# Altium project volumetric-display-boards.PrjPcb (part 2 of 2)
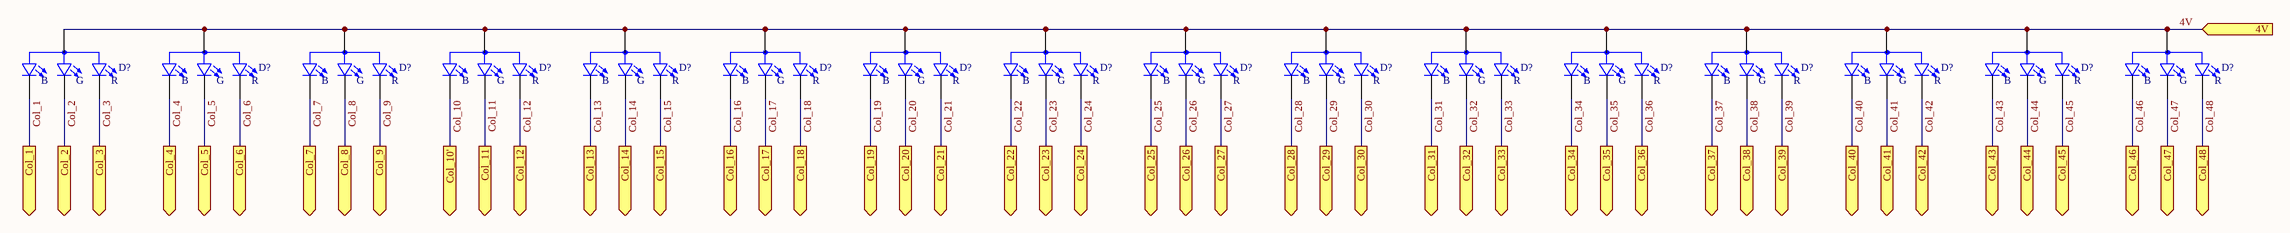
[diagram p2: LED_Row.SchDoc]

## Nets that join several sheets
4V: LED_Row1 (16 pins), LED_Row2 (16 pins), LED_Row3 (16 pins), LED_Row4 (16 pins), LED_Row5 (16 pins), LED_Row6 (16 pins), LED_Row7 (16 pins), LED_Row8 (16 pins), LED_Row9 (16 pins), LED_Row10 (16 pins), LED_Row11 (16 pins), LED_Row12 (16 pins), LED_Row13 (16 pins), LED_Row14 (16 pins), LED_Row15 (16 pins), LED_Row16 (16 pins), LED_Row17 (16 pins), LED_Row18 (16 pins), LED_Row19 (16 pins), LED_Row20 (16 pins), LED_Row21 (16 pins), LED_Row22 (16 pins), LED_Row23 (16 pins), LED_Row24 (16 pins)
Col_1: LED_Row1 (D1_LED_Row1.2), LED_Row2 (D1_LED_Row2.2), LED_Row3 (D1_LED_Row3.2), LED_Row4 (D1_LED_Row4.2), LED_Row5 (D1_LED_Row5.2), LED_Row6 (D1_LED_Row6.2), LED_Row7 (D1_LED_Row7.2), LED_Row8 (D1_LED_Row8.2), LED_Row9 (D1_LED_Row9.2), LED_Row10 (D1_LED_Row10.2), LED_Row11 (D1_LED_Row11.2), LED_Row12 (D1_LED_Row12.2), LED_Row13 (D1_LED_Row13.2), LED_Row14 (D1_LED_Row14.2), LED_Row15 (D1_LED_Row15.2), LED_Row16 (D1_LED_Row16.2), LED_Row17 (D1_LED_Row17.2), LED_Row18 (D1_LED_Row18.2), LED_Row19 (D1_LED_Row19.2), LED_Row20 (D1_LED_Row20.2), LED_Row21 (D1_LED_Row21.2), LED_Row22 (D1_LED_Row22.2), LED_Row23 (D1_LED_Row23.2), LED_Row24 (D1_LED_Row24.2)
Col_2: LED_Row1 (D1_LED_Row1.1), LED_Row2 (D1_LED_Row2.1), LED_Row3 (D1_LED_Row3.1), LED_Row4 (D1_LED_Row4.1), LED_Row5 (D1_LED_Row5.1), LED_Row6 (D1_LED_Row6.1), LED_Row7 (D1_LED_Row7.1), LED_Row8 (D1_LED_Row8.1), LED_Row9 (D1_LED_Row9.1), LED_Row10 (D1_LED_Row10.1), LED_Row11 (D1_LED_Row11.1), LED_Row12 (D1_LED_Row12.1), LED_Row13 (D1_LED_Row13.1), LED_Row14 (D1_LED_Row14.1), LED_Row15 (D1_LED_Row15.1), LED_Row16 (D1_LED_Row16.1), LED_Row17 (D1_LED_Row17.1), LED_Row18 (D1_LED_Row18.1), LED_Row19 (D1_LED_Row19.1), LED_Row20 (D1_LED_Row20.1), LED_Row21 (D1_LED_Row21.1), LED_Row22 (D1_LED_Row22.1), LED_Row23 (D1_LED_Row23.1), LED_Row24 (D1_LED_Row24.1)
Col_3: LED_Row1 (D1_LED_Row1.4), LED_Row2 (D1_LED_Row2.4), LED_Row3 (D1_LED_Row3.4), LED_Row4 (D1_LED_Row4.4), LED_Row5 (D1_LED_Row5.4), LED_Row6 (D1_LED_Row6.4), LED_Row7 (D1_LED_Row7.4), LED_Row8 (D1_LED_Row8.4), LED_Row9 (D1_LED_Row9.4), LED_Row10 (D1_LED_Row10.4), LED_Row11 (D1_LED_Row11.4), LED_Row12 (D1_LED_Row12.4), LED_Row13 (D1_LED_Row13.4), LED_Row14 (D1_LED_Row14.4), LED_Row15 (D1_LED_Row15.4), LED_Row16 (D1_LED_Row16.4), LED_Row17 (D1_LED_Row17.4), LED_Row18 (D1_LED_Row18.4), LED_Row19 (D1_LED_Row19.4), LED_Row20 (D1_LED_Row20.4), LED_Row21 (D1_LED_Row21.4), LED_Row22 (D1_LED_Row22.4), LED_Row23 (D1_LED_Row23.4), LED_Row24 (D1_LED_Row24.4)
Col_4: LED_Row1 (D2_LED_Row1.2), LED_Row2 (D2_LED_Row2.2), LED_Row3 (D2_LED_Row3.2), LED_Row4 (D2_LED_Row4.2), LED_Row5 (D2_LED_Row5.2), LED_Row6 (D2_LED_Row6.2), LED_Row7 (D2_LED_Row7.2), LED_Row8 (D2_LED_Row8.2), LED_Row9 (D2_LED_Row9.2), LED_Row10 (D2_LED_Row10.2), LED_Row11 (D2_LED_Row11.2), LED_Row12 (D2_LED_Row12.2), LED_Row13 (D2_LED_Row13.2), LED_Row14 (D2_LED_Row14.2), LED_Row15 (D2_LED_Row15.2), LED_Row16 (D2_LED_Row16.2), LED_Row17 (D2_LED_Row17.2), LED_Row18 (D2_LED_Row18.2), LED_Row19 (D2_LED_Row19.2), LED_Row20 (D2_LED_Row20.2), LED_Row21 (D2_LED_Row21.2), LED_Row22 (D2_LED_Row22.2), LED_Row23 (D2_LED_Row23.2), LED_Row24 (D2_LED_Row24.2)
Col_5: LED_Row1 (D2_LED_Row1.1), LED_Row2 (D2_LED_Row2.1), LED_Row3 (D2_LED_Row3.1), LED_Row4 (D2_LED_Row4.1), LED_Row5 (D2_LED_Row5.1), LED_Row6 (D2_LED_Row6.1), LED_Row7 (D2_LED_Row7.1), LED_Row8 (D2_LED_Row8.1), LED_Row9 (D2_LED_Row9.1), LED_Row10 (D2_LED_Row10.1), LED_Row11 (D2_LED_Row11.1), LED_Row12 (D2_LED_Row12.1), LED_Row13 (D2_LED_Row13.1), LED_Row14 (D2_LED_Row14.1), LED_Row15 (D2_LED_Row15.1), LED_Row16 (D2_LED_Row16.1), LED_Row17 (D2_LED_Row17.1), LED_Row18 (D2_LED_Row18.1), LED_Row19 (D2_LED_Row19.1), LED_Row20 (D2_LED_Row20.1), LED_Row21 (D2_LED_Row21.1), LED_Row22 (D2_LED_Row22.1), LED_Row23 (D2_LED_Row23.1), LED_Row24 (D2_LED_Row24.1)
Col_6: LED_Row1 (D2_LED_Row1.4), LED_Row2 (D2_LED_Row2.4), LED_Row3 (D2_LED_Row3.4), LED_Row4 (D2_LED_Row4.4), LED_Row5 (D2_LED_Row5.4), LED_Row6 (D2_LED_Row6.4), LED_Row7 (D2_LED_Row7.4), LED_Row8 (D2_LED_Row8.4), LED_Row9 (D2_LED_Row9.4), LED_Row10 (D2_LED_Row10.4), LED_Row11 (D2_LED_Row11.4), LED_Row12 (D2_LED_Row12.4), LED_Row13 (D2_LED_Row13.4), LED_Row14 (D2_LED_Row14.4), LED_Row15 (D2_LED_Row15.4), LED_Row16 (D2_LED_Row16.4), LED_Row17 (D2_LED_Row17.4), LED_Row18 (D2_LED_Row18.4), LED_Row19 (D2_LED_Row19.4), LED_Row20 (D2_LED_Row20.4), LED_Row21 (D2_LED_Row21.4), LED_Row22 (D2_LED_Row22.4), LED_Row23 (D2_LED_Row23.4), LED_Row24 (D2_LED_Row24.4)
Col_7: LED_Row1 (D3_LED_Row1.2), LED_Row2 (D3_LED_Row2.2), LED_Row3 (D3_LED_Row3.2), LED_Row4 (D3_LED_Row4.2), LED_Row5 (D3_LED_Row5.2), LED_Row6 (D3_LED_Row6.2), LED_Row7 (D3_LED_Row7.2), LED_Row8 (D3_LED_Row8.2), LED_Row9 (D3_LED_Row9.2), LED_Row10 (D3_LED_Row10.2), LED_Row11 (D3_LED_Row11.2), LED_Row12 (D3_LED_Row12.2), LED_Row13 (D3_LED_Row13.2), LED_Row14 (D3_LED_Row14.2), LED_Row15 (D3_LED_Row15.2), LED_Row16 (D3_LED_Row16.2), LED_Row17 (D3_LED_Row17.2), LED_Row18 (D3_LED_Row18.2), LED_Row19 (D3_LED_Row19.2), LED_Row20 (D3_LED_Row20.2), LED_Row21 (D3_LED_Row21.2), LED_Row22 (D3_LED_Row22.2), LED_Row23 (D3_LED_Row23.2), LED_Row24 (D3_LED_Row24.2)
Col_8: LED_Row1 (D3_LED_Row1.1), LED_Row2 (D3_LED_Row2.1), LED_Row3 (D3_LED_Row3.1), LED_Row4 (D3_LED_Row4.1), LED_Row5 (D3_LED_Row5.1), LED_Row6 (D3_LED_Row6.1), LED_Row7 (D3_LED_Row7.1), LED_Row8 (D3_LED_Row8.1), LED_Row9 (D3_LED_Row9.1), LED_Row10 (D3_LED_Row10.1), LED_Row11 (D3_LED_Row11.1), LED_Row12 (D3_LED_Row12.1), LED_Row13 (D3_LED_Row13.1), LED_Row14 (D3_LED_Row14.1), LED_Row15 (D3_LED_Row15.1), LED_Row16 (D3_LED_Row16.1), LED_Row17 (D3_LED_Row17.1), LED_Row18 (D3_LED_Row18.1), LED_Row19 (D3_LED_Row19.1), LED_Row20 (D3_LED_Row20.1), LED_Row21 (D3_LED_Row21.1), LED_Row22 (D3_LED_Row22.1), LED_Row23 (D3_LED_Row23.1), LED_Row24 (D3_LED_Row24.1)
Col_9: LED_Row1 (D3_LED_Row1.4), LED_Row2 (D3_LED_Row2.4), LED_Row3 (D3_LED_Row3.4), LED_Row4 (D3_LED_Row4.4), LED_Row5 (D3_LED_Row5.4), LED_Row6 (D3_LED_Row6.4), LED_Row7 (D3_LED_Row7.4), LED_Row8 (D3_LED_Row8.4), LED_Row9 (D3_LED_Row9.4), LED_Row10 (D3_LED_Row10.4), LED_Row11 (D3_LED_Row11.4), LED_Row12 (D3_LED_Row12.4), LED_Row13 (D3_LED_Row13.4), LED_Row14 (D3_LED_Row14.4), LED_Row15 (D3_LED_Row15.4), LED_Row16 (D3_LED_Row16.4), LED_Row17 (D3_LED_Row17.4), LED_Row18 (D3_LED_Row18.4), LED_Row19 (D3_LED_Row19.4), LED_Row20 (D3_LED_Row20.4), LED_Row21 (D3_LED_Row21.4), LED_Row22 (D3_LED_Row22.4), LED_Row23 (D3_LED_Row23.4), LED_Row24 (D3_LED_Row24.4)
Col_10: LED_Row1 (D4_LED_Row1.2), LED_Row2 (D4_LED_Row2.2), LED_Row3 (D4_LED_Row3.2), LED_Row4 (D4_LED_Row4.2), LED_Row5 (D4_LED_Row5.2), LED_Row6 (D4_LED_Row6.2), LED_Row7 (D4_LED_Row7.2), LED_Row8 (D4_LED_Row8.2), LED_Row9 (D4_LED_Row9.2), LED_Row10 (D4_LED_Row10.2), LED_Row11 (D4_LED_Row11.2), LED_Row12 (D4_LED_Row12.2), LED_Row13 (D4_LED_Row13.2), LED_Row14 (D4_LED_Row14.2), LED_Row15 (D4_LED_Row15.2), LED_Row16 (D4_LED_Row16.2), LED_Row17 (D4_LED_Row17.2), LED_Row18 (D4_LED_Row18.2), LED_Row19 (D4_LED_Row19.2), LED_Row20 (D4_LED_Row20.2), LED_Row21 (D4_LED_Row21.2), LED_Row22 (D4_LED_Row22.2), LED_Row23 (D4_LED_Row23.2), LED_Row24 (D4_LED_Row24.2)
Col_11: LED_Row1 (D4_LED_Row1.1), LED_Row2 (D4_LED_Row2.1), LED_Row3 (D4_LED_Row3.1), LED_Row4 (D4_LED_Row4.1), LED_Row5 (D4_LED_Row5.1), LED_Row6 (D4_LED_Row6.1), LED_Row7 (D4_LED_Row7.1), LED_Row8 (D4_LED_Row8.1), LED_Row9 (D4_LED_Row9.1), LED_Row10 (D4_LED_Row10.1), LED_Row11 (D4_LED_Row11.1), LED_Row12 (D4_LED_Row12.1), LED_Row13 (D4_LED_Row13.1), LED_Row14 (D4_LED_Row14.1), LED_Row15 (D4_LED_Row15.1), LED_Row16 (D4_LED_Row16.1), LED_Row17 (D4_LED_Row17.1), LED_Row18 (D4_LED_Row18.1), LED_Row19 (D4_LED_Row19.1), LED_Row20 (D4_LED_Row20.1), LED_Row21 (D4_LED_Row21.1), LED_Row22 (D4_LED_Row22.1), LED_Row23 (D4_LED_Row23.1), LED_Row24 (D4_LED_Row24.1)
Col_12: LED_Row1 (D4_LED_Row1.4), LED_Row2 (D4_LED_Row2.4), LED_Row3 (D4_LED_Row3.4), LED_Row4 (D4_LED_Row4.4), LED_Row5 (D4_LED_Row5.4), LED_Row6 (D4_LED_Row6.4), LED_Row7 (D4_LED_Row7.4), LED_Row8 (D4_LED_Row8.4), LED_Row9 (D4_LED_Row9.4), LED_Row10 (D4_LED_Row10.4), LED_Row11 (D4_LED_Row11.4), LED_Row12 (D4_LED_Row12.4), LED_Row13 (D4_LED_Row13.4), LED_Row14 (D4_LED_Row14.4), LED_Row15 (D4_LED_Row15.4), LED_Row16 (D4_LED_Row16.4), LED_Row17 (D4_LED_Row17.4), LED_Row18 (D4_LED_Row18.4), LED_Row19 (D4_LED_Row19.4), LED_Row20 (D4_LED_Row20.4), LED_Row21 (D4_LED_Row21.4), LED_Row22 (D4_LED_Row22.4), LED_Row23 (D4_LED_Row23.4), LED_Row24 (D4_LED_Row24.4)
Col_13: LED_Row1 (D5_LED_Row1.2), LED_Row2 (D5_LED_Row2.2), LED_Row3 (D5_LED_Row3.2), LED_Row4 (D5_LED_Row4.2), LED_Row5 (D5_LED_Row5.2), LED_Row6 (D5_LED_Row6.2), LED_Row7 (D5_LED_Row7.2), LED_Row8 (D5_LED_Row8.2), LED_Row9 (D5_LED_Row9.2), LED_Row10 (D5_LED_Row10.2), LED_Row11 (D5_LED_Row11.2), LED_Row12 (D5_LED_Row12.2), LED_Row13 (D5_LED_Row13.2), LED_Row14 (D5_LED_Row14.2), LED_Row15 (D5_LED_Row15.2), LED_Row16 (D5_LED_Row16.2), LED_Row17 (D5_LED_Row17.2), LED_Row18 (D5_LED_Row18.2), LED_Row19 (D5_LED_Row19.2), LED_Row20 (D5_LED_Row20.2), LED_Row21 (D5_LED_Row21.2), LED_Row22 (D5_LED_Row22.2), LED_Row23 (D5_LED_Row23.2), LED_Row24 (D5_LED_Row24.2)
Col_14: LED_Row1 (D5_LED_Row1.1), LED_Row2 (D5_LED_Row2.1), LED_Row3 (D5_LED_Row3.1), LED_Row4 (D5_LED_Row4.1), LED_Row5 (D5_LED_Row5.1), LED_Row6 (D5_LED_Row6.1), LED_Row7 (D5_LED_Row7.1), LED_Row8 (D5_LED_Row8.1), LED_Row9 (D5_LED_Row9.1), LED_Row10 (D5_LED_Row10.1), LED_Row11 (D5_LED_Row11.1), LED_Row12 (D5_LED_Row12.1), LED_Row13 (D5_LED_Row13.1), LED_Row14 (D5_LED_Row14.1), LED_Row15 (D5_LED_Row15.1), LED_Row16 (D5_LED_Row16.1), LED_Row17 (D5_LED_Row17.1), LED_Row18 (D5_LED_Row18.1), LED_Row19 (D5_LED_Row19.1), LED_Row20 (D5_LED_Row20.1), LED_Row21 (D5_LED_Row21.1), LED_Row22 (D5_LED_Row22.1), LED_Row23 (D5_LED_Row23.1), LED_Row24 (D5_LED_Row24.1)
Col_15: LED_Row1 (D5_LED_Row1.4), LED_Row2 (D5_LED_Row2.4), LED_Row3 (D5_LED_Row3.4), LED_Row4 (D5_LED_Row4.4), LED_Row5 (D5_LED_Row5.4), LED_Row6 (D5_LED_Row6.4), LED_Row7 (D5_LED_Row7.4), LED_Row8 (D5_LED_Row8.4), LED_Row9 (D5_LED_Row9.4), LED_Row10 (D5_LED_Row10.4), LED_Row11 (D5_LED_Row11.4), LED_Row12 (D5_LED_Row12.4), LED_Row13 (D5_LED_Row13.4), LED_Row14 (D5_LED_Row14.4), LED_Row15 (D5_LED_Row15.4), LED_Row16 (D5_LED_Row16.4), LED_Row17 (D5_LED_Row17.4), LED_Row18 (D5_LED_Row18.4), LED_Row19 (D5_LED_Row19.4), LED_Row20 (D5_LED_Row20.4), LED_Row21 (D5_LED_Row21.4), LED_Row22 (D5_LED_Row22.4), LED_Row23 (D5_LED_Row23.4), LED_Row24 (D5_LED_Row24.4)
Col_16: LED_Row1 (D6_LED_Row1.2), LED_Row2 (D6_LED_Row2.2), LED_Row3 (D6_LED_Row3.2), LED_Row4 (D6_LED_Row4.2), LED_Row5 (D6_LED_Row5.2), LED_Row6 (D6_LED_Row6.2), LED_Row7 (D6_LED_Row7.2), LED_Row8 (D6_LED_Row8.2), LED_Row9 (D6_LED_Row9.2), LED_Row10 (D6_LED_Row10.2), LED_Row11 (D6_LED_Row11.2), LED_Row12 (D6_LED_Row12.2), LED_Row13 (D6_LED_Row13.2), LED_Row14 (D6_LED_Row14.2), LED_Row15 (D6_LED_Row15.2), LED_Row16 (D6_LED_Row16.2), LED_Row17 (D6_LED_Row17.2), LED_Row18 (D6_LED_Row18.2), LED_Row19 (D6_LED_Row19.2), LED_Row20 (D6_LED_Row20.2), LED_Row21 (D6_LED_Row21.2), LED_Row22 (D6_LED_Row22.2), LED_Row23 (D6_LED_Row23.2), LED_Row24 (D6_LED_Row24.2)
Col_17: LED_Row1 (D6_LED_Row1.1), LED_Row2 (D6_LED_Row2.1), LED_Row3 (D6_LED_Row3.1), LED_Row4 (D6_LED_Row4.1), LED_Row5 (D6_LED_Row5.1), LED_Row6 (D6_LED_Row6.1), LED_Row7 (D6_LED_Row7.1), LED_Row8 (D6_LED_Row8.1), LED_Row9 (D6_LED_Row9.1), LED_Row10 (D6_LED_Row10.1), LED_Row11 (D6_LED_Row11.1), LED_Row12 (D6_LED_Row12.1), LED_Row13 (D6_LED_Row13.1), LED_Row14 (D6_LED_Row14.1), LED_Row15 (D6_LED_Row15.1), LED_Row16 (D6_LED_Row16.1), LED_Row17 (D6_LED_Row17.1), LED_Row18 (D6_LED_Row18.1), LED_Row19 (D6_LED_Row19.1), LED_Row20 (D6_LED_Row20.1), LED_Row21 (D6_LED_Row21.1), LED_Row22 (D6_LED_Row22.1), LED_Row23 (D6_LED_Row23.1), LED_Row24 (D6_LED_Row24.1)
Col_18: LED_Row1 (D6_LED_Row1.4), LED_Row2 (D6_LED_Row2.4), LED_Row3 (D6_LED_Row3.4), LED_Row4 (D6_LED_Row4.4), LED_Row5 (D6_LED_Row5.4), LED_Row6 (D6_LED_Row6.4), LED_Row7 (D6_LED_Row7.4), LED_Row8 (D6_LED_Row8.4), LED_Row9 (D6_LED_Row9.4), LED_Row10 (D6_LED_Row10.4), LED_Row11 (D6_LED_Row11.4), LED_Row12 (D6_LED_Row12.4), LED_Row13 (D6_LED_Row13.4), LED_Row14 (D6_LED_Row14.4), LED_Row15 (D6_LED_Row15.4), LED_Row16 (D6_LED_Row16.4), LED_Row17 (D6_LED_Row17.4), LED_Row18 (D6_LED_Row18.4), LED_Row19 (D6_LED_Row19.4), LED_Row20 (D6_LED_Row20.4), LED_Row21 (D6_LED_Row21.4), LED_Row22 (D6_LED_Row22.4), LED_Row23 (D6_LED_Row23.4), LED_Row24 (D6_LED_Row24.4)
Col_19: LED_Row1 (D7_LED_Row1.2), LED_Row2 (D7_LED_Row2.2), LED_Row3 (D7_LED_Row3.2), LED_Row4 (D7_LED_Row4.2), LED_Row5 (D7_LED_Row5.2), LED_Row6 (D7_LED_Row6.2), LED_Row7 (D7_LED_Row7.2), LED_Row8 (D7_LED_Row8.2), LED_Row9 (D7_LED_Row9.2), LED_Row10 (D7_LED_Row10.2), LED_Row11 (D7_LED_Row11.2), LED_Row12 (D7_LED_Row12.2), LED_Row13 (D7_LED_Row13.2), LED_Row14 (D7_LED_Row14.2), LED_Row15 (D7_LED_Row15.2), LED_Row16 (D7_LED_Row16.2), LED_Row17 (D7_LED_Row17.2), LED_Row18 (D7_LED_Row18.2), LED_Row19 (D7_LED_Row19.2), LED_Row20 (D7_LED_Row20.2), LED_Row21 (D7_LED_Row21.2), LED_Row22 (D7_LED_Row22.2), LED_Row23 (D7_LED_Row23.2), LED_Row24 (D7_LED_Row24.2)
Col_20: LED_Row1 (D7_LED_Row1.1), LED_Row2 (D7_LED_Row2.1), LED_Row3 (D7_LED_Row3.1), LED_Row4 (D7_LED_Row4.1), LED_Row5 (D7_LED_Row5.1), LED_Row6 (D7_LED_Row6.1), LED_Row7 (D7_LED_Row7.1), LED_Row8 (D7_LED_Row8.1), LED_Row9 (D7_LED_Row9.1), LED_Row10 (D7_LED_Row10.1), LED_Row11 (D7_LED_Row11.1), LED_Row12 (D7_LED_Row12.1), LED_Row13 (D7_LED_Row13.1), LED_Row14 (D7_LED_Row14.1), LED_Row15 (D7_LED_Row15.1), LED_Row16 (D7_LED_Row16.1), LED_Row17 (D7_LED_Row17.1), LED_Row18 (D7_LED_Row18.1), LED_Row19 (D7_LED_Row19.1), LED_Row20 (D7_LED_Row20.1), LED_Row21 (D7_LED_Row21.1), LED_Row22 (D7_LED_Row22.1), LED_Row23 (D7_LED_Row23.1), LED_Row24 (D7_LED_Row24.1)
Col_21: LED_Row1 (D7_LED_Row1.4), LED_Row2 (D7_LED_Row2.4), LED_Row3 (D7_LED_Row3.4), LED_Row4 (D7_LED_Row4.4), LED_Row5 (D7_LED_Row5.4), LED_Row6 (D7_LED_Row6.4), LED_Row7 (D7_LED_Row7.4), LED_Row8 (D7_LED_Row8.4), LED_Row9 (D7_LED_Row9.4), LED_Row10 (D7_LED_Row10.4), LED_Row11 (D7_LED_Row11.4), LED_Row12 (D7_LED_Row12.4), LED_Row13 (D7_LED_Row13.4), LED_Row14 (D7_LED_Row14.4), LED_Row15 (D7_LED_Row15.4), LED_Row16 (D7_LED_Row16.4), LED_Row17 (D7_LED_Row17.4), LED_Row18 (D7_LED_Row18.4), LED_Row19 (D7_LED_Row19.4), LED_Row20 (D7_LED_Row20.4), LED_Row21 (D7_LED_Row21.4), LED_Row22 (D7_LED_Row22.4), LED_Row23 (D7_LED_Row23.4), LED_Row24 (D7_LED_Row24.4)
Col_22: LED_Row1 (D8_LED_Row1.2), LED_Row2 (D8_LED_Row2.2), LED_Row3 (D8_LED_Row3.2), LED_Row4 (D8_LED_Row4.2), LED_Row5 (D8_LED_Row5.2), LED_Row6 (D8_LED_Row6.2), LED_Row7 (D8_LED_Row7.2), LED_Row8 (D8_LED_Row8.2), LED_Row9 (D8_LED_Row9.2), LED_Row10 (D8_LED_Row10.2), LED_Row11 (D8_LED_Row11.2), LED_Row12 (D8_LED_Row12.2), LED_Row13 (D8_LED_Row13.2), LED_Row14 (D8_LED_Row14.2), LED_Row15 (D8_LED_Row15.2), LED_Row16 (D8_LED_Row16.2), LED_Row17 (D8_LED_Row17.2), LED_Row18 (D8_LED_Row18.2), LED_Row19 (D8_LED_Row19.2), LED_Row20 (D8_LED_Row20.2), LED_Row21 (D8_LED_Row21.2), LED_Row22 (D8_LED_Row22.2), LED_Row23 (D8_LED_Row23.2), LED_Row24 (D8_LED_Row24.2)
Col_23: LED_Row1 (D8_LED_Row1.1), LED_Row2 (D8_LED_Row2.1), LED_Row3 (D8_LED_Row3.1), LED_Row4 (D8_LED_Row4.1), LED_Row5 (D8_LED_Row5.1), LED_Row6 (D8_LED_Row6.1), LED_Row7 (D8_LED_Row7.1), LED_Row8 (D8_LED_Row8.1), LED_Row9 (D8_LED_Row9.1), LED_Row10 (D8_LED_Row10.1), LED_Row11 (D8_LED_Row11.1), LED_Row12 (D8_LED_Row12.1), LED_Row13 (D8_LED_Row13.1), LED_Row14 (D8_LED_Row14.1), LED_Row15 (D8_LED_Row15.1), LED_Row16 (D8_LED_Row16.1), LED_Row17 (D8_LED_Row17.1), LED_Row18 (D8_LED_Row18.1), LED_Row19 (D8_LED_Row19.1), LED_Row20 (D8_LED_Row20.1), LED_Row21 (D8_LED_Row21.1), LED_Row22 (D8_LED_Row22.1), LED_Row23 (D8_LED_Row23.1), LED_Row24 (D8_LED_Row24.1)
Col_24: LED_Row1 (D8_LED_Row1.4), LED_Row2 (D8_LED_Row2.4), LED_Row3 (D8_LED_Row3.4), LED_Row4 (D8_LED_Row4.4), LED_Row5 (D8_LED_Row5.4), LED_Row6 (D8_LED_Row6.4), LED_Row7 (D8_LED_Row7.4), LED_Row8 (D8_LED_Row8.4), LED_Row9 (D8_LED_Row9.4), LED_Row10 (D8_LED_Row10.4), LED_Row11 (D8_LED_Row11.4), LED_Row12 (D8_LED_Row12.4), LED_Row13 (D8_LED_Row13.4), LED_Row14 (D8_LED_Row14.4), LED_Row15 (D8_LED_Row15.4), LED_Row16 (D8_LED_Row16.4), LED_Row17 (D8_LED_Row17.4), LED_Row18 (D8_LED_Row18.4), LED_Row19 (D8_LED_Row19.4), LED_Row20 (D8_LED_Row20.4), LED_Row21 (D8_LED_Row21.4), LED_Row22 (D8_LED_Row22.4), LED_Row23 (D8_LED_Row23.4), LED_Row24 (D8_LED_Row24.4)
Col_25: LED_Row1 (D9_LED_Row1.2), LED_Row2 (D9_LED_Row2.2), LED_Row3 (D9_LED_Row3.2), LED_Row4 (D9_LED_Row4.2), LED_Row5 (D9_LED_Row5.2), LED_Row6 (D9_LED_Row6.2), LED_Row7 (D9_LED_Row7.2), LED_Row8 (D9_LED_Row8.2), LED_Row9 (D9_LED_Row9.2), LED_Row10 (D9_LED_Row10.2), LED_Row11 (D9_LED_Row11.2), LED_Row12 (D9_LED_Row12.2), LED_Row13 (D9_LED_Row13.2), LED_Row14 (D9_LED_Row14.2), LED_Row15 (D9_LED_Row15.2), LED_Row16 (D9_LED_Row16.2), LED_Row17 (D9_LED_Row17.2), LED_Row18 (D9_LED_Row18.2), LED_Row19 (D9_LED_Row19.2), LED_Row20 (D9_LED_Row20.2), LED_Row21 (D9_LED_Row21.2), LED_Row22 (D9_LED_Row22.2), LED_Row23 (D9_LED_Row23.2), LED_Row24 (D9_LED_Row24.2)
Col_26: LED_Row1 (D9_LED_Row1.1), LED_Row2 (D9_LED_Row2.1), LED_Row3 (D9_LED_Row3.1), LED_Row4 (D9_LED_Row4.1), LED_Row5 (D9_LED_Row5.1), LED_Row6 (D9_LED_Row6.1), LED_Row7 (D9_LED_Row7.1), LED_Row8 (D9_LED_Row8.1), LED_Row9 (D9_LED_Row9.1), LED_Row10 (D9_LED_Row10.1), LED_Row11 (D9_LED_Row11.1), LED_Row12 (D9_LED_Row12.1), LED_Row13 (D9_LED_Row13.1), LED_Row14 (D9_LED_Row14.1), LED_Row15 (D9_LED_Row15.1), LED_Row16 (D9_LED_Row16.1), LED_Row17 (D9_LED_Row17.1), LED_Row18 (D9_LED_Row18.1), LED_Row19 (D9_LED_Row19.1), LED_Row20 (D9_LED_Row20.1), LED_Row21 (D9_LED_Row21.1), LED_Row22 (D9_LED_Row22.1), LED_Row23 (D9_LED_Row23.1), LED_Row24 (D9_LED_Row24.1)
Col_27: LED_Row1 (D9_LED_Row1.4), LED_Row2 (D9_LED_Row2.4), LED_Row3 (D9_LED_Row3.4), LED_Row4 (D9_LED_Row4.4), LED_Row5 (D9_LED_Row5.4), LED_Row6 (D9_LED_Row6.4), LED_Row7 (D9_LED_Row7.4), LED_Row8 (D9_LED_Row8.4), LED_Row9 (D9_LED_Row9.4), LED_Row10 (D9_LED_Row10.4), LED_Row11 (D9_LED_Row11.4), LED_Row12 (D9_LED_Row12.4), LED_Row13 (D9_LED_Row13.4), LED_Row14 (D9_LED_Row14.4), LED_Row15 (D9_LED_Row15.4), LED_Row16 (D9_LED_Row16.4), LED_Row17 (D9_LED_Row17.4), LED_Row18 (D9_LED_Row18.4), LED_Row19 (D9_LED_Row19.4), LED_Row20 (D9_LED_Row20.4), LED_Row21 (D9_LED_Row21.4), LED_Row22 (D9_LED_Row22.4), LED_Row23 (D9_LED_Row23.4), LED_Row24 (D9_LED_Row24.4)
Col_28: LED_Row1 (D10_LED_Row1.2), LED_Row2 (D10_LED_Row2.2), LED_Row3 (D10_LED_Row3.2), LED_Row4 (D10_LED_Row4.2), LED_Row5 (D10_LED_Row5.2), LED_Row6 (D10_LED_Row6.2), LED_Row7 (D10_LED_Row7.2), LED_Row8 (D10_LED_Row8.2), LED_Row9 (D10_LED_Row9.2), LED_Row10 (D10_LED_Row10.2), LED_Row11 (D10_LED_Row11.2), LED_Row12 (D10_LED_Row12.2), LED_Row13 (D10_LED_Row13.2), LED_Row14 (D10_LED_Row14.2), LED_Row15 (D10_LED_Row15.2), LED_Row16 (D10_LED_Row16.2), LED_Row17 (D10_LED_Row17.2), LED_Row18 (D10_LED_Row18.2), LED_Row19 (D10_LED_Row19.2), LED_Row20 (D10_LED_Row20.2), LED_Row21 (D10_LED_Row21.2), LED_Row22 (D10_LED_Row22.2), LED_Row23 (D10_LED_Row23.2), LED_Row24 (D10_LED_Row24.2)
Col_29: LED_Row1 (D10_LED_Row1.1), LED_Row2 (D10_LED_Row2.1), LED_Row3 (D10_LED_Row3.1), LED_Row4 (D10_LED_Row4.1), LED_Row5 (D10_LED_Row5.1), LED_Row6 (D10_LED_Row6.1), LED_Row7 (D10_LED_Row7.1), LED_Row8 (D10_LED_Row8.1), LED_Row9 (D10_LED_Row9.1), LED_Row10 (D10_LED_Row10.1), LED_Row11 (D10_LED_Row11.1), LED_Row12 (D10_LED_Row12.1), LED_Row13 (D10_LED_Row13.1), LED_Row14 (D10_LED_Row14.1), LED_Row15 (D10_LED_Row15.1), LED_Row16 (D10_LED_Row16.1), LED_Row17 (D10_LED_Row17.1), LED_Row18 (D10_LED_Row18.1), LED_Row19 (D10_LED_Row19.1), LED_Row20 (D10_LED_Row20.1), LED_Row21 (D10_LED_Row21.1), LED_Row22 (D10_LED_Row22.1), LED_Row23 (D10_LED_Row23.1), LED_Row24 (D10_LED_Row24.1)
Col_30: LED_Row1 (D10_LED_Row1.4), LED_Row2 (D10_LED_Row2.4), LED_Row3 (D10_LED_Row3.4), LED_Row4 (D10_LED_Row4.4), LED_Row5 (D10_LED_Row5.4), LED_Row6 (D10_LED_Row6.4), LED_Row7 (D10_LED_Row7.4), LED_Row8 (D10_LED_Row8.4), LED_Row9 (D10_LED_Row9.4), LED_Row10 (D10_LED_Row10.4), LED_Row11 (D10_LED_Row11.4), LED_Row12 (D10_LED_Row12.4), LED_Row13 (D10_LED_Row13.4), LED_Row14 (D10_LED_Row14.4), LED_Row15 (D10_LED_Row15.4), LED_Row16 (D10_LED_Row16.4), LED_Row17 (D10_LED_Row17.4), LED_Row18 (D10_LED_Row18.4), LED_Row19 (D10_LED_Row19.4), LED_Row20 (D10_LED_Row20.4), LED_Row21 (D10_LED_Row21.4), LED_Row22 (D10_LED_Row22.4), LED_Row23 (D10_LED_Row23.4), LED_Row24 (D10_LED_Row24.4)
Col_31: LED_Row1 (D11_LED_Row1.2), LED_Row2 (D11_LED_Row2.2), LED_Row3 (D11_LED_Row3.2), LED_Row4 (D11_LED_Row4.2), LED_Row5 (D11_LED_Row5.2), LED_Row6 (D11_LED_Row6.2), LED_Row7 (D11_LED_Row7.2), LED_Row8 (D11_LED_Row8.2), LED_Row9 (D11_LED_Row9.2), LED_Row10 (D11_LED_Row10.2), LED_Row11 (D11_LED_Row11.2), LED_Row12 (D11_LED_Row12.2), LED_Row13 (D11_LED_Row13.2), LED_Row14 (D11_LED_Row14.2), LED_Row15 (D11_LED_Row15.2), LED_Row16 (D11_LED_Row16.2), LED_Row17 (D11_LED_Row17.2), LED_Row18 (D11_LED_Row18.2), LED_Row19 (D11_LED_Row19.2), LED_Row20 (D11_LED_Row20.2), LED_Row21 (D11_LED_Row21.2), LED_Row22 (D11_LED_Row22.2), LED_Row23 (D11_LED_Row23.2), LED_Row24 (D11_LED_Row24.2)
Col_32: LED_Row1 (D11_LED_Row1.1), LED_Row2 (D11_LED_Row2.1), LED_Row3 (D11_LED_Row3.1), LED_Row4 (D11_LED_Row4.1), LED_Row5 (D11_LED_Row5.1), LED_Row6 (D11_LED_Row6.1), LED_Row7 (D11_LED_Row7.1), LED_Row8 (D11_LED_Row8.1), LED_Row9 (D11_LED_Row9.1), LED_Row10 (D11_LED_Row10.1), LED_Row11 (D11_LED_Row11.1), LED_Row12 (D11_LED_Row12.1), LED_Row13 (D11_LED_Row13.1), LED_Row14 (D11_LED_Row14.1), LED_Row15 (D11_LED_Row15.1), LED_Row16 (D11_LED_Row16.1), LED_Row17 (D11_LED_Row17.1), LED_Row18 (D11_LED_Row18.1), LED_Row19 (D11_LED_Row19.1), LED_Row20 (D11_LED_Row20.1), LED_Row21 (D11_LED_Row21.1), LED_Row22 (D11_LED_Row22.1), LED_Row23 (D11_LED_Row23.1), LED_Row24 (D11_LED_Row24.1)
Col_33: LED_Row1 (D11_LED_Row1.4), LED_Row2 (D11_LED_Row2.4), LED_Row3 (D11_LED_Row3.4), LED_Row4 (D11_LED_Row4.4), LED_Row5 (D11_LED_Row5.4), LED_Row6 (D11_LED_Row6.4), LED_Row7 (D11_LED_Row7.4), LED_Row8 (D11_LED_Row8.4), LED_Row9 (D11_LED_Row9.4), LED_Row10 (D11_LED_Row10.4), LED_Row11 (D11_LED_Row11.4), LED_Row12 (D11_LED_Row12.4), LED_Row13 (D11_LED_Row13.4), LED_Row14 (D11_LED_Row14.4), LED_Row15 (D11_LED_Row15.4), LED_Row16 (D11_LED_Row16.4), LED_Row17 (D11_LED_Row17.4), LED_Row18 (D11_LED_Row18.4), LED_Row19 (D11_LED_Row19.4), LED_Row20 (D11_LED_Row20.4), LED_Row21 (D11_LED_Row21.4), LED_Row22 (D11_LED_Row22.4), LED_Row23 (D11_LED_Row23.4), LED_Row24 (D11_LED_Row24.4)
Col_34: LED_Row1 (D12_LED_Row1.2), LED_Row2 (D12_LED_Row2.2), LED_Row3 (D12_LED_Row3.2), LED_Row4 (D12_LED_Row4.2), LED_Row5 (D12_LED_Row5.2), LED_Row6 (D12_LED_Row6.2), LED_Row7 (D12_LED_Row7.2), LED_Row8 (D12_LED_Row8.2), LED_Row9 (D12_LED_Row9.2), LED_Row10 (D12_LED_Row10.2), LED_Row11 (D12_LED_Row11.2), LED_Row12 (D12_LED_Row12.2), LED_Row13 (D12_LED_Row13.2), LED_Row14 (D12_LED_Row14.2), LED_Row15 (D12_LED_Row15.2), LED_Row16 (D12_LED_Row16.2), LED_Row17 (D12_LED_Row17.2), LED_Row18 (D12_LED_Row18.2), LED_Row19 (D12_LED_Row19.2), LED_Row20 (D12_LED_Row20.2), LED_Row21 (D12_LED_Row21.2), LED_Row22 (D12_LED_Row22.2), LED_Row23 (D12_LED_Row23.2), LED_Row24 (D12_LED_Row24.2)
Col_35: LED_Row1 (D12_LED_Row1.1), LED_Row2 (D12_LED_Row2.1), LED_Row3 (D12_LED_Row3.1), LED_Row4 (D12_LED_Row4.1), LED_Row5 (D12_LED_Row5.1), LED_Row6 (D12_LED_Row6.1), LED_Row7 (D12_LED_Row7.1), LED_Row8 (D12_LED_Row8.1), LED_Row9 (D12_LED_Row9.1), LED_Row10 (D12_LED_Row10.1), LED_Row11 (D12_LED_Row11.1), LED_Row12 (D12_LED_Row12.1), LED_Row13 (D12_LED_Row13.1), LED_Row14 (D12_LED_Row14.1), LED_Row15 (D12_LED_Row15.1), LED_Row16 (D12_LED_Row16.1), LED_Row17 (D12_LED_Row17.1), LED_Row18 (D12_LED_Row18.1), LED_Row19 (D12_LED_Row19.1), LED_Row20 (D12_LED_Row20.1), LED_Row21 (D12_LED_Row21.1), LED_Row22 (D12_LED_Row22.1), LED_Row23 (D12_LED_Row23.1), LED_Row24 (D12_LED_Row24.1)
Col_36: LED_Row1 (D12_LED_Row1.4), LED_Row2 (D12_LED_Row2.4), LED_Row3 (D12_LED_Row3.4), LED_Row4 (D12_LED_Row4.4), LED_Row5 (D12_LED_Row5.4), LED_Row6 (D12_LED_Row6.4), LED_Row7 (D12_LED_Row7.4), LED_Row8 (D12_LED_Row8.4), LED_Row9 (D12_LED_Row9.4), LED_Row10 (D12_LED_Row10.4), LED_Row11 (D12_LED_Row11.4), LED_Row12 (D12_LED_Row12.4), LED_Row13 (D12_LED_Row13.4), LED_Row14 (D12_LED_Row14.4), LED_Row15 (D12_LED_Row15.4), LED_Row16 (D12_LED_Row16.4), LED_Row17 (D12_LED_Row17.4), LED_Row18 (D12_LED_Row18.4), LED_Row19 (D12_LED_Row19.4), LED_Row20 (D12_LED_Row20.4), LED_Row21 (D12_LED_Row21.4), LED_Row22 (D12_LED_Row22.4), LED_Row23 (D12_LED_Row23.4), LED_Row24 (D12_LED_Row24.4)
Col_37: LED_Row1 (D13_LED_Row1.2), LED_Row2 (D13_LED_Row2.2), LED_Row3 (D13_LED_Row3.2), LED_Row4 (D13_LED_Row4.2), LED_Row5 (D13_LED_Row5.2), LED_Row6 (D13_LED_Row6.2), LED_Row7 (D13_LED_Row7.2), LED_Row8 (D13_LED_Row8.2), LED_Row9 (D13_LED_Row9.2), LED_Row10 (D13_LED_Row10.2), LED_Row11 (D13_LED_Row11.2), LED_Row12 (D13_LED_Row12.2), LED_Row13 (D13_LED_Row13.2), LED_Row14 (D13_LED_Row14.2), LED_Row15 (D13_LED_Row15.2), LED_Row16 (D13_LED_Row16.2), LED_Row17 (D13_LED_Row17.2), LED_Row18 (D13_LED_Row18.2), LED_Row19 (D13_LED_Row19.2), LED_Row20 (D13_LED_Row20.2), LED_Row21 (D13_LED_Row21.2), LED_Row22 (D13_LED_Row22.2), LED_Row23 (D13_LED_Row23.2), LED_Row24 (D13_LED_Row24.2)
Col_38: LED_Row1 (D13_LED_Row1.1), LED_Row2 (D13_LED_Row2.1), LED_Row3 (D13_LED_Row3.1), LED_Row4 (D13_LED_Row4.1), LED_Row5 (D13_LED_Row5.1), LED_Row6 (D13_LED_Row6.1), LED_Row7 (D13_LED_Row7.1), LED_Row8 (D13_LED_Row8.1), LED_Row9 (D13_LED_Row9.1), LED_Row10 (D13_LED_Row10.1), LED_Row11 (D13_LED_Row11.1), LED_Row12 (D13_LED_Row12.1), LED_Row13 (D13_LED_Row13.1), LED_Row14 (D13_LED_Row14.1), LED_Row15 (D13_LED_Row15.1), LED_Row16 (D13_LED_Row16.1), LED_Row17 (D13_LED_Row17.1), LED_Row18 (D13_LED_Row18.1), LED_Row19 (D13_LED_Row19.1), LED_Row20 (D13_LED_Row20.1), LED_Row21 (D13_LED_Row21.1), LED_Row22 (D13_LED_Row22.1), LED_Row23 (D13_LED_Row23.1), LED_Row24 (D13_LED_Row24.1)
Col_39: LED_Row1 (D13_LED_Row1.4), LED_Row2 (D13_LED_Row2.4), LED_Row3 (D13_LED_Row3.4), LED_Row4 (D13_LED_Row4.4), LED_Row5 (D13_LED_Row5.4), LED_Row6 (D13_LED_Row6.4), LED_Row7 (D13_LED_Row7.4), LED_Row8 (D13_LED_Row8.4), LED_Row9 (D13_LED_Row9.4), LED_Row10 (D13_LED_Row10.4), LED_Row11 (D13_LED_Row11.4), LED_Row12 (D13_LED_Row12.4), LED_Row13 (D13_LED_Row13.4), LED_Row14 (D13_LED_Row14.4), LED_Row15 (D13_LED_Row15.4), LED_Row16 (D13_LED_Row16.4), LED_Row17 (D13_LED_Row17.4), LED_Row18 (D13_LED_Row18.4), LED_Row19 (D13_LED_Row19.4), LED_Row20 (D13_LED_Row20.4), LED_Row21 (D13_LED_Row21.4), LED_Row22 (D13_LED_Row22.4), LED_Row23 (D13_LED_Row23.4), LED_Row24 (D13_LED_Row24.4)
Col_40: LED_Row1 (D14_LED_Row1.2), LED_Row2 (D14_LED_Row2.2), LED_Row3 (D14_LED_Row3.2), LED_Row4 (D14_LED_Row4.2), LED_Row5 (D14_LED_Row5.2), LED_Row6 (D14_LED_Row6.2), LED_Row7 (D14_LED_Row7.2), LED_Row8 (D14_LED_Row8.2), LED_Row9 (D14_LED_Row9.2), LED_Row10 (D14_LED_Row10.2), LED_Row11 (D14_LED_Row11.2), LED_Row12 (D14_LED_Row12.2), LED_Row13 (D14_LED_Row13.2), LED_Row14 (D14_LED_Row14.2), LED_Row15 (D14_LED_Row15.2), LED_Row16 (D14_LED_Row16.2), LED_Row17 (D14_LED_Row17.2), LED_Row18 (D14_LED_Row18.2), LED_Row19 (D14_LED_Row19.2), LED_Row20 (D14_LED_Row20.2), LED_Row21 (D14_LED_Row21.2), LED_Row22 (D14_LED_Row22.2), LED_Row23 (D14_LED_Row23.2), LED_Row24 (D14_LED_Row24.2)
Col_41: LED_Row1 (D14_LED_Row1.1), LED_Row2 (D14_LED_Row2.1), LED_Row3 (D14_LED_Row3.1), LED_Row4 (D14_LED_Row4.1), LED_Row5 (D14_LED_Row5.1), LED_Row6 (D14_LED_Row6.1), LED_Row7 (D14_LED_Row7.1), LED_Row8 (D14_LED_Row8.1), LED_Row9 (D14_LED_Row9.1), LED_Row10 (D14_LED_Row10.1), LED_Row11 (D14_LED_Row11.1), LED_Row12 (D14_LED_Row12.1), LED_Row13 (D14_LED_Row13.1), LED_Row14 (D14_LED_Row14.1), LED_Row15 (D14_LED_Row15.1), LED_Row16 (D14_LED_Row16.1), LED_Row17 (D14_LED_Row17.1), LED_Row18 (D14_LED_Row18.1), LED_Row19 (D14_LED_Row19.1), LED_Row20 (D14_LED_Row20.1), LED_Row21 (D14_LED_Row21.1), LED_Row22 (D14_LED_Row22.1), LED_Row23 (D14_LED_Row23.1), LED_Row24 (D14_LED_Row24.1)
Col_42: LED_Row1 (D14_LED_Row1.4), LED_Row2 (D14_LED_Row2.4), LED_Row3 (D14_LED_Row3.4), LED_Row4 (D14_LED_Row4.4), LED_Row5 (D14_LED_Row5.4), LED_Row6 (D14_LED_Row6.4), LED_Row7 (D14_LED_Row7.4), LED_Row8 (D14_LED_Row8.4), LED_Row9 (D14_LED_Row9.4), LED_Row10 (D14_LED_Row10.4), LED_Row11 (D14_LED_Row11.4), LED_Row12 (D14_LED_Row12.4), LED_Row13 (D14_LED_Row13.4), LED_Row14 (D14_LED_Row14.4), LED_Row15 (D14_LED_Row15.4), LED_Row16 (D14_LED_Row16.4), LED_Row17 (D14_LED_Row17.4), LED_Row18 (D14_LED_Row18.4), LED_Row19 (D14_LED_Row19.4), LED_Row20 (D14_LED_Row20.4), LED_Row21 (D14_LED_Row21.4), LED_Row22 (D14_LED_Row22.4), LED_Row23 (D14_LED_Row23.4), LED_Row24 (D14_LED_Row24.4)
Col_43: LED_Row1 (D15_LED_Row1.2), LED_Row2 (D15_LED_Row2.2), LED_Row3 (D15_LED_Row3.2), LED_Row4 (D15_LED_Row4.2), LED_Row5 (D15_LED_Row5.2), LED_Row6 (D15_LED_Row6.2), LED_Row7 (D15_LED_Row7.2), LED_Row8 (D15_LED_Row8.2), LED_Row9 (D15_LED_Row9.2), LED_Row10 (D15_LED_Row10.2), LED_Row11 (D15_LED_Row11.2), LED_Row12 (D15_LED_Row12.2), LED_Row13 (D15_LED_Row13.2), LED_Row14 (D15_LED_Row14.2), LED_Row15 (D15_LED_Row15.2), LED_Row16 (D15_LED_Row16.2), LED_Row17 (D15_LED_Row17.2), LED_Row18 (D15_LED_Row18.2), LED_Row19 (D15_LED_Row19.2), LED_Row20 (D15_LED_Row20.2), LED_Row21 (D15_LED_Row21.2), LED_Row22 (D15_LED_Row22.2), LED_Row23 (D15_LED_Row23.2), LED_Row24 (D15_LED_Row24.2)
Col_44: LED_Row1 (D15_LED_Row1.1), LED_Row2 (D15_LED_Row2.1), LED_Row3 (D15_LED_Row3.1), LED_Row4 (D15_LED_Row4.1), LED_Row5 (D15_LED_Row5.1), LED_Row6 (D15_LED_Row6.1), LED_Row7 (D15_LED_Row7.1), LED_Row8 (D15_LED_Row8.1), LED_Row9 (D15_LED_Row9.1), LED_Row10 (D15_LED_Row10.1), LED_Row11 (D15_LED_Row11.1), LED_Row12 (D15_LED_Row12.1), LED_Row13 (D15_LED_Row13.1), LED_Row14 (D15_LED_Row14.1), LED_Row15 (D15_LED_Row15.1), LED_Row16 (D15_LED_Row16.1), LED_Row17 (D15_LED_Row17.1), LED_Row18 (D15_LED_Row18.1), LED_Row19 (D15_LED_Row19.1), LED_Row20 (D15_LED_Row20.1), LED_Row21 (D15_LED_Row21.1), LED_Row22 (D15_LED_Row22.1), LED_Row23 (D15_LED_Row23.1), LED_Row24 (D15_LED_Row24.1)
Col_45: LED_Row1 (D15_LED_Row1.4), LED_Row2 (D15_LED_Row2.4), LED_Row3 (D15_LED_Row3.4), LED_Row4 (D15_LED_Row4.4), LED_Row5 (D15_LED_Row5.4), LED_Row6 (D15_LED_Row6.4), LED_Row7 (D15_LED_Row7.4), LED_Row8 (D15_LED_Row8.4), LED_Row9 (D15_LED_Row9.4), LED_Row10 (D15_LED_Row10.4), LED_Row11 (D15_LED_Row11.4), LED_Row12 (D15_LED_Row12.4), LED_Row13 (D15_LED_Row13.4), LED_Row14 (D15_LED_Row14.4), LED_Row15 (D15_LED_Row15.4), LED_Row16 (D15_LED_Row16.4), LED_Row17 (D15_LED_Row17.4), LED_Row18 (D15_LED_Row18.4), LED_Row19 (D15_LED_Row19.4), LED_Row20 (D15_LED_Row20.4), LED_Row21 (D15_LED_Row21.4), LED_Row22 (D15_LED_Row22.4), LED_Row23 (D15_LED_Row23.4), LED_Row24 (D15_LED_Row24.4)
Col_46: LED_Row1 (D16_LED_Row1.2), LED_Row2 (D16_LED_Row2.2), LED_Row3 (D16_LED_Row3.2), LED_Row4 (D16_LED_Row4.2), LED_Row5 (D16_LED_Row5.2), LED_Row6 (D16_LED_Row6.2), LED_Row7 (D16_LED_Row7.2), LED_Row8 (D16_LED_Row8.2), LED_Row9 (D16_LED_Row9.2), LED_Row10 (D16_LED_Row10.2), LED_Row11 (D16_LED_Row11.2), LED_Row12 (D16_LED_Row12.2), LED_Row13 (D16_LED_Row13.2), LED_Row14 (D16_LED_Row14.2), LED_Row15 (D16_LED_Row15.2), LED_Row16 (D16_LED_Row16.2), LED_Row17 (D16_LED_Row17.2), LED_Row18 (D16_LED_Row18.2), LED_Row19 (D16_LED_Row19.2), LED_Row20 (D16_LED_Row20.2), LED_Row21 (D16_LED_Row21.2), LED_Row22 (D16_LED_Row22.2), LED_Row23 (D16_LED_Row23.2), LED_Row24 (D16_LED_Row24.2)
Col_47: LED_Row1 (D16_LED_Row1.1), LED_Row2 (D16_LED_Row2.1), LED_Row3 (D16_LED_Row3.1), LED_Row4 (D16_LED_Row4.1), LED_Row5 (D16_LED_Row5.1), LED_Row6 (D16_LED_Row6.1), LED_Row7 (D16_LED_Row7.1), LED_Row8 (D16_LED_Row8.1), LED_Row9 (D16_LED_Row9.1), LED_Row10 (D16_LED_Row10.1), LED_Row11 (D16_LED_Row11.1), LED_Row12 (D16_LED_Row12.1), LED_Row13 (D16_LED_Row13.1), LED_Row14 (D16_LED_Row14.1), LED_Row15 (D16_LED_Row15.1), LED_Row16 (D16_LED_Row16.1), LED_Row17 (D16_LED_Row17.1), LED_Row18 (D16_LED_Row18.1), LED_Row19 (D16_LED_Row19.1), LED_Row20 (D16_LED_Row20.1), LED_Row21 (D16_LED_Row21.1), LED_Row22 (D16_LED_Row22.1), LED_Row23 (D16_LED_Row23.1), LED_Row24 (D16_LED_Row24.1)
Col_48: LED_Row1 (D16_LED_Row1.4), LED_Row2 (D16_LED_Row2.4), LED_Row3 (D16_LED_Row3.4), LED_Row4 (D16_LED_Row4.4), LED_Row5 (D16_LED_Row5.4), LED_Row6 (D16_LED_Row6.4), LED_Row7 (D16_LED_Row7.4), LED_Row8 (D16_LED_Row8.4), LED_Row9 (D16_LED_Row9.4), LED_Row10 (D16_LED_Row10.4), LED_Row11 (D16_LED_Row11.4), LED_Row12 (D16_LED_Row12.4), LED_Row13 (D16_LED_Row13.4), LED_Row14 (D16_LED_Row14.4), LED_Row15 (D16_LED_Row15.4), LED_Row16 (D16_LED_Row16.4), LED_Row17 (D16_LED_Row17.4), LED_Row18 (D16_LED_Row18.4), LED_Row19 (D16_LED_Row19.4), LED_Row20 (D16_LED_Row20.4), LED_Row21 (D16_LED_Row21.4), LED_Row22 (D16_LED_Row22.4), LED_Row23 (D16_LED_Row23.4), LED_Row24 (D16_LED_Row24.4)